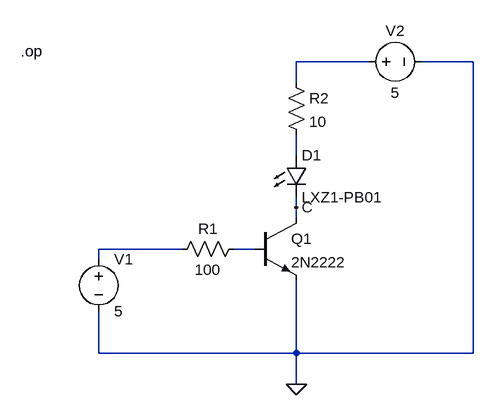
[diagram p0: schematic bjt_switch_led.asc]
bjt_switch_led.asc, the LTspice schematic file:
Version 4
SHEET 1 880 680
WIRE 288 0 176 0
WIRE 448 0 368 0
WIRE 176 32 176 0
WIRE 176 144 176 112
WIRE 176 224 176 208
WIRE 176 240 176 224
WIRE 0 288 -128 288
WIRE 112 288 80 288
WIRE -128 304 -128 288
WIRE -128 448 -128 384
WIRE 176 448 176 336
WIRE 176 448 -128 448
WIRE 448 448 448 0
WIRE 448 448 176 448
WIRE 176 496 176 448
FLAG 176 496 0
FLAG 176 224 C
SYMBOL npn 112 240 R0
SYMATTR InstName Q1
SYMATTR Value 2N2222
SYMBOL res -16 304 R270
WINDOW 0 32 56 VTop 2
WINDOW 3 0 56 VBottom 2
SYMATTR InstName R1
SYMATTR Value 100
SYMBOL LED 160 144 R0
SYMATTR InstName D1
SYMATTR Value LXZ1-PB01
SYMBOL res 160 16 R0
SYMATTR InstName R2
SYMATTR Value 10
SYMBOL voltage -128 288 R0
SYMATTR InstName V1
SYMATTR Value 5
SYMBOL voltage 272 0 R270
WINDOW 0 32 56 VTop 2
WINDOW 3 -32 56 VBottom 2
SYMATTR InstName V2
SYMATTR Value 5
TEXT -248 -16 Left 2 !.op

The netlist it stands for:
* bjt_switch_led.asc
Q1 C N004 0 0 2N2222
R1 N003 N004 100
D1 N002 C LXZ1-PB01
R2 N001 N002 10
V1 N003 0 5
V2 N001 0 5
.model D D
.lib standard.dio
.model NPN NPN
.model PNP PNP
.lib standard.bjt
.op
.backanno
.end